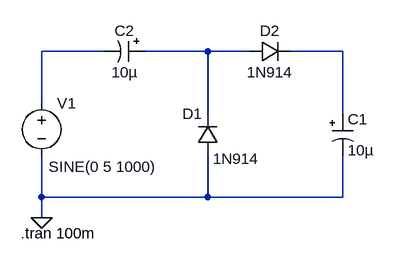
[diagram p0: schematic podvouvach.asc]
podvouvach.asc, the LTspice schematic file:
Version 4
SHEET 1 880 680
WIRE 144 32 48 32
WIRE 304 32 208 32
WIRE 368 32 304 32
WIRE 512 32 432 32
WIRE 48 112 48 32
WIRE 304 128 304 32
WIRE 512 128 512 32
WIRE 48 256 48 192
WIRE 304 256 304 192
WIRE 304 256 48 256
WIRE 512 256 512 192
WIRE 512 256 304 256
WIRE 48 288 48 256
FLAG 48 288 0
SYMBOL polcap 496 128 R0
SYMATTR InstName C1
SYMATTR Value 10µ
SYMBOL diode 320 192 R180
WINDOW 0 24 64 Left 2
WINDOW 3 8 -5 Right 2
SYMATTR InstName D1
SYMATTR Value 1N914
SYMBOL diode 368 48 R270
WINDOW 0 32 32 VTop 2
WINDOW 3 0 32 VBottom 2
SYMATTR InstName D2
SYMATTR Value 1N914
SYMBOL polcap 208 16 R90
WINDOW 0 0 32 VBottom 2
WINDOW 3 32 32 VTop 2
SYMATTR InstName C2
SYMATTR Value 10µ
SYMBOL voltage 48 96 R0
WINDOW 123 0 0 Left 2
WINDOW 39 0 0 Left 2
WINDOW 3 11 113 Left 2
SYMATTR InstName V1
SYMATTR Value SINE(0 5 1000)
TEXT 16 312 Left 2 !.tran 100m

The netlist it stands for:
* podvouvach.asc
C1 N003 0 10µ
D1 0 N002 1N914
D2 N002 N003 1N914
C2 N002 N001 10µ
V1 N001 0 SINE(0 5 1000)
.model D D
.lib standard.dio
.tran 100m
.backanno
.end